# Altium schematic sheet relay.SchDoc
size A
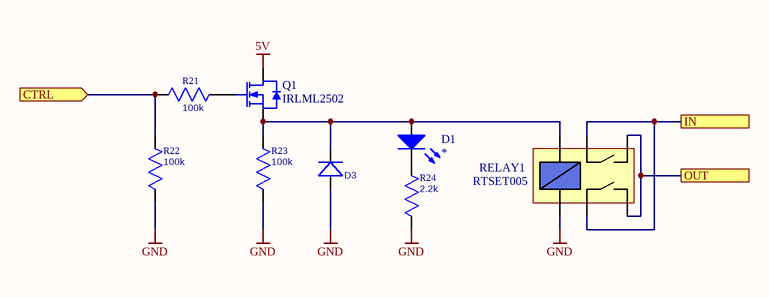
[diagram p0: relay.SchDoc]

## Parts
D1  *  [LED_5mm]
D3  D_DO-214AC  [DO-214AC]  (value not drawn)
Q1  IRLML2502  [SOT23]
R21  100k  [R_0603]
R22  100k  [R_0603]
R23  100k  [R_0603]
R24  2.2k  [R_0603]
RELAY1  RTSET005  [RTSET005]

## Ports
CTRL (in), IN, OUT

## Nets
5V: Q1.3(D)
GND: D3.1(A) R22.2 R23.2 R24.1 RELAY1.6
CTRL: R21.2 R22.1 ; port CTRL
IN: RELAY1.3 RELAY1.4 ; port IN
OUT: RELAY1.1 RELAY1.2 ; port OUT
NetD1_1: D1.1(A) D3.2(K) Q1.2(S) R23.1 RELAY1.5
NetD1_2: D1.2(K) R24.2
NetQ1_1: Q1.1(G) R21.1

## Library data of the parts
D1 = LED_5mm: Typical INFRARED GaAs LED; Value: *; Color: *
D3 = D_DO-214AC: Diode
Q1 = N-ch_SOT23: N-Channel Enhancement Mode MOSFET; Published: 17-Dec-2003; DatasheetVersion: May-99; PackageVersion: 1996; PackageReference: SOT23; Publisher: Altium Limited; PackageDescription: SOT-23; 3 Leads; Body 3.1 x 2.5 mm, inc. leads (LxW max), Alternate Lead Configuration; ComponentLink1Description: Manufacturer Link; ComponentLink1URL: http://www.zetex.com/; ComponentLink2Description: Datasheet; ComponentLink2URL: www.zetex.com/3.0/pdf/ZXM61N02F.pdf
R21-R24 = R0603: Resistor
  R21-R23: Value: 100k
  R24: Value: 2.2k
RELAY1 = 1-1415898-8: General Purpose Relay